# Altium schematic sheet BLOCK DIAGRAM.SchDoc: SYSTEM BLOCK DIAGRAM
size 420 x 297 mm
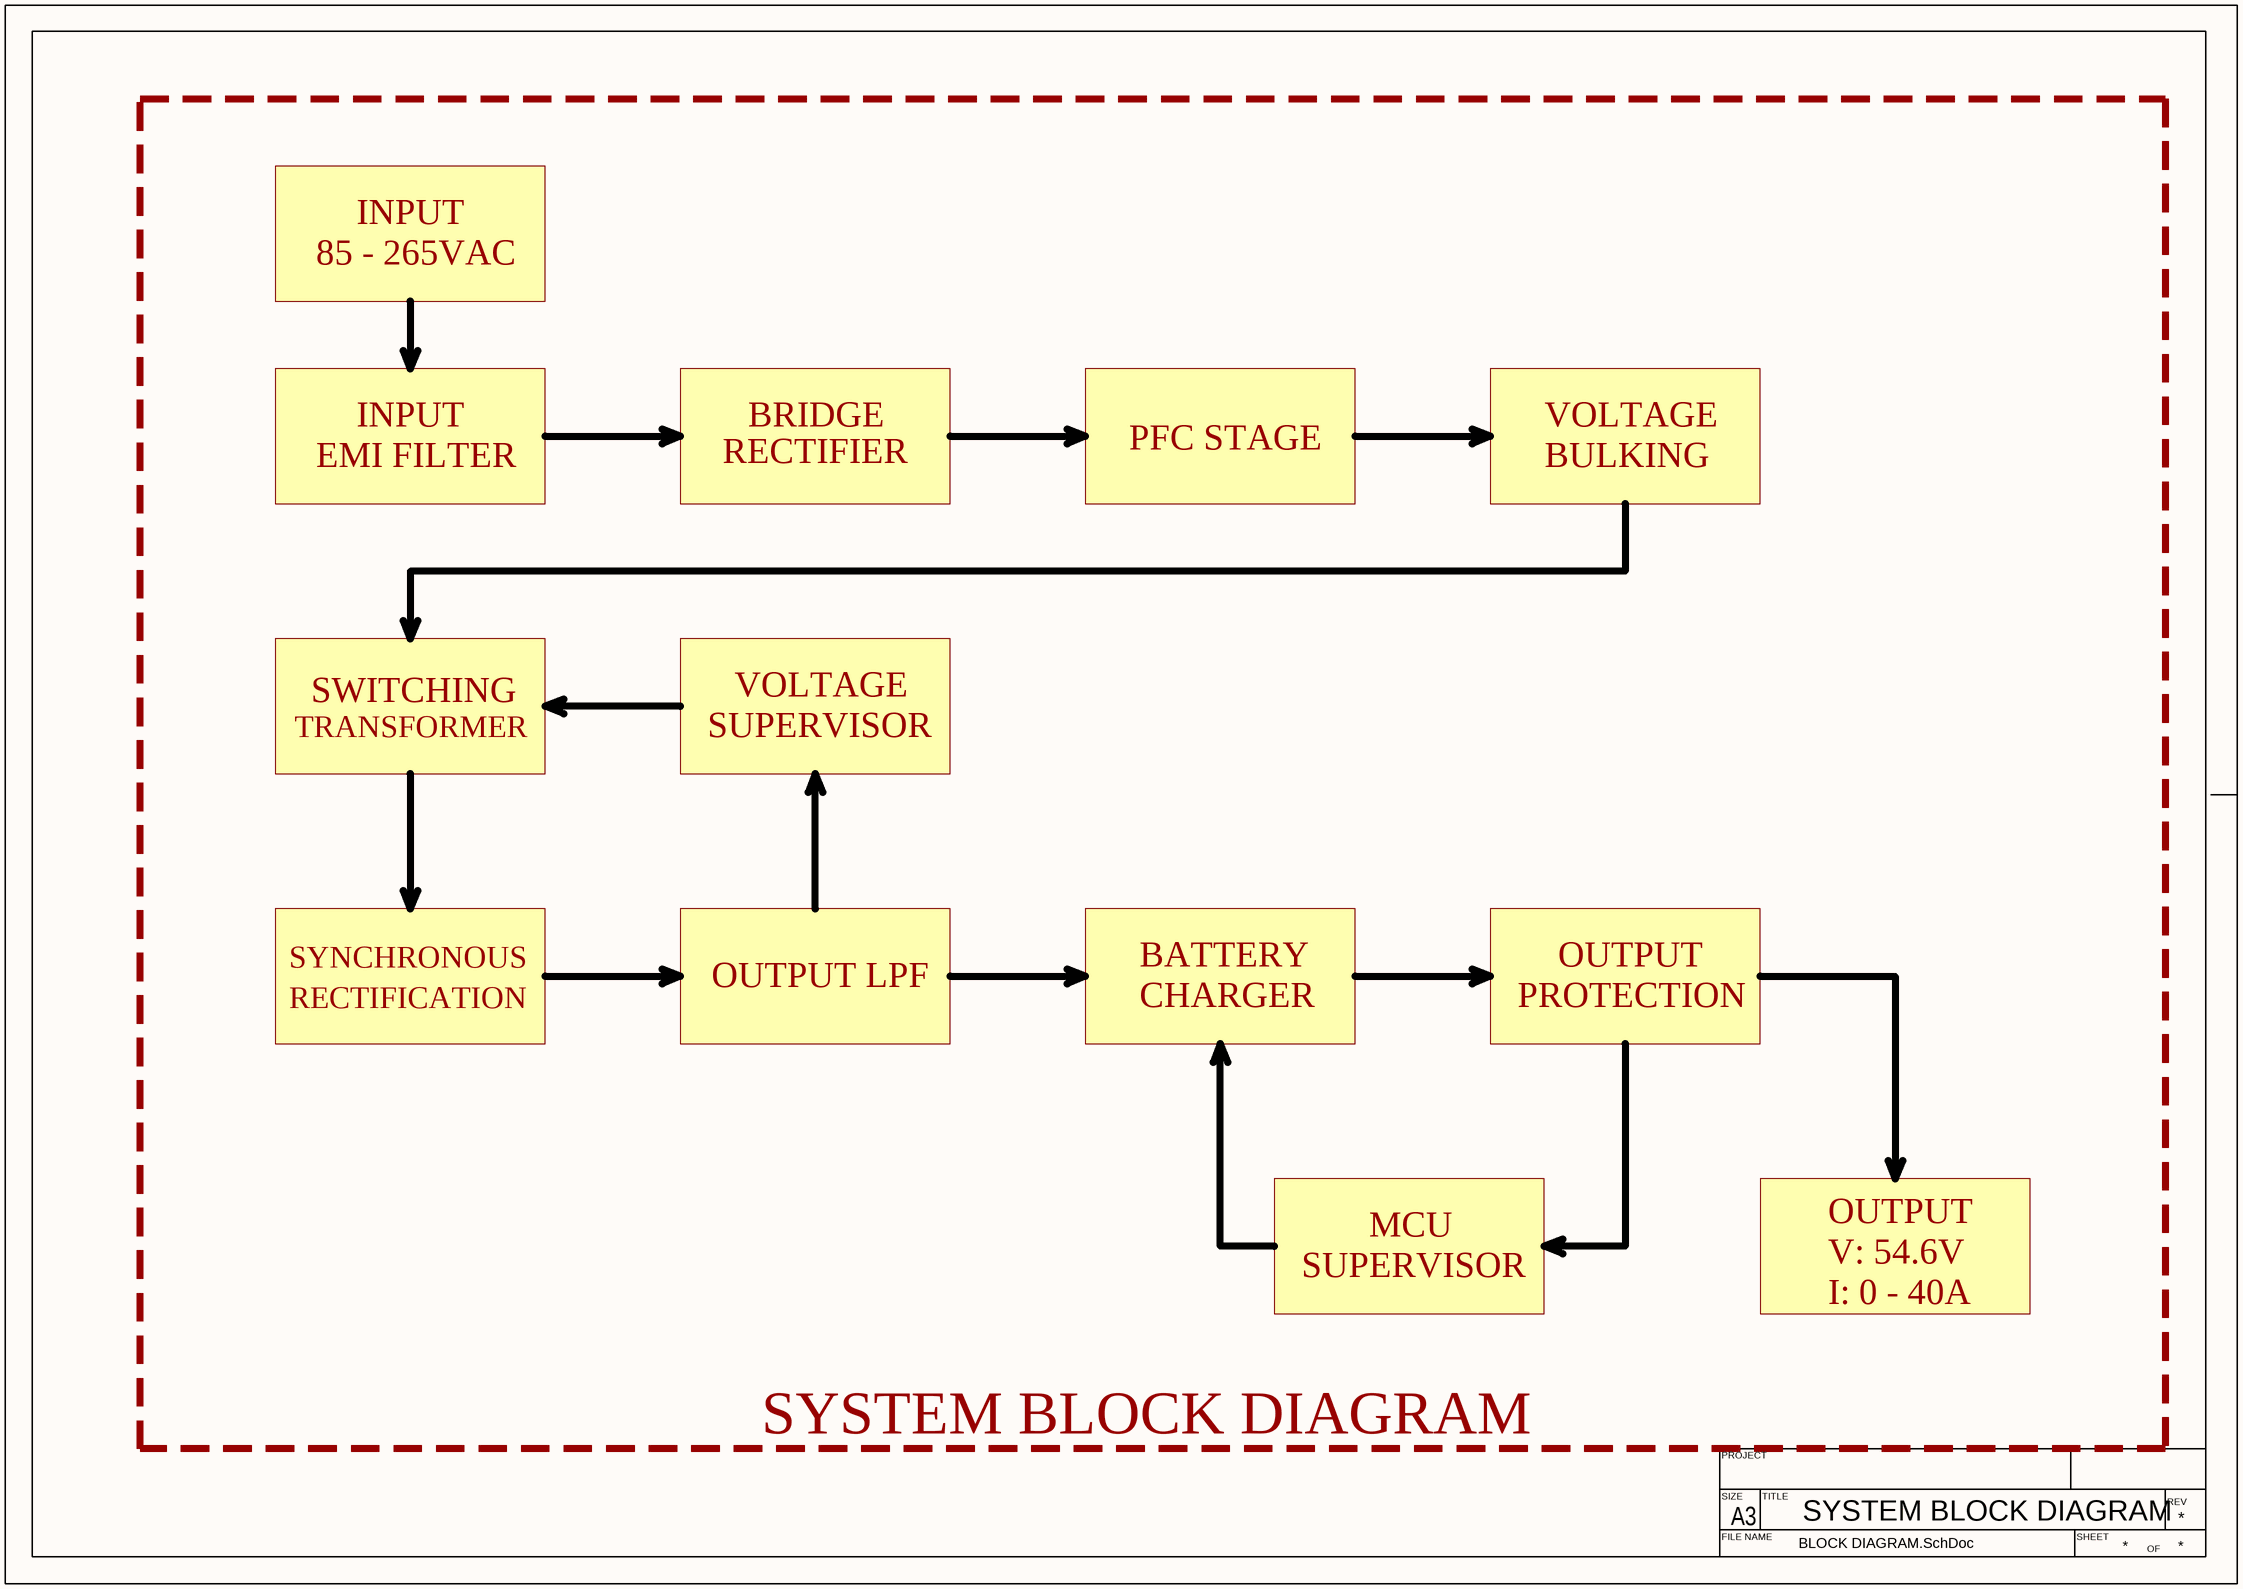
[diagram p0: BLOCK DIAGRAM.SchDoc]

## Notes on the sheet
- INPUT
- 85 - 265VAC
- BRIDGE
- PFC STAGE
- VOLTAGE
- EMI FILTER
- RECTIFIER
- BULKING
- SWITCHING
- TRANSFORMER
- SUPERVISOR
- SYNCHRONOUS
- OUTPUT LPF
- BATTERY
- OUTPUT
- RECTIFICATION
- CHARGER
- PROTECTION
- MCU
- V: 54.6V
- I: 0 - 40A
- SYSTEM BLOCK DIAGRAM
- PROJECT
- SIZE
- FILE NAME
- A3
- TITLE
- SHEET
- OF
- REV